# Altium project UPCNSL-ABS-PVC-DEP-1B.PrjPcb
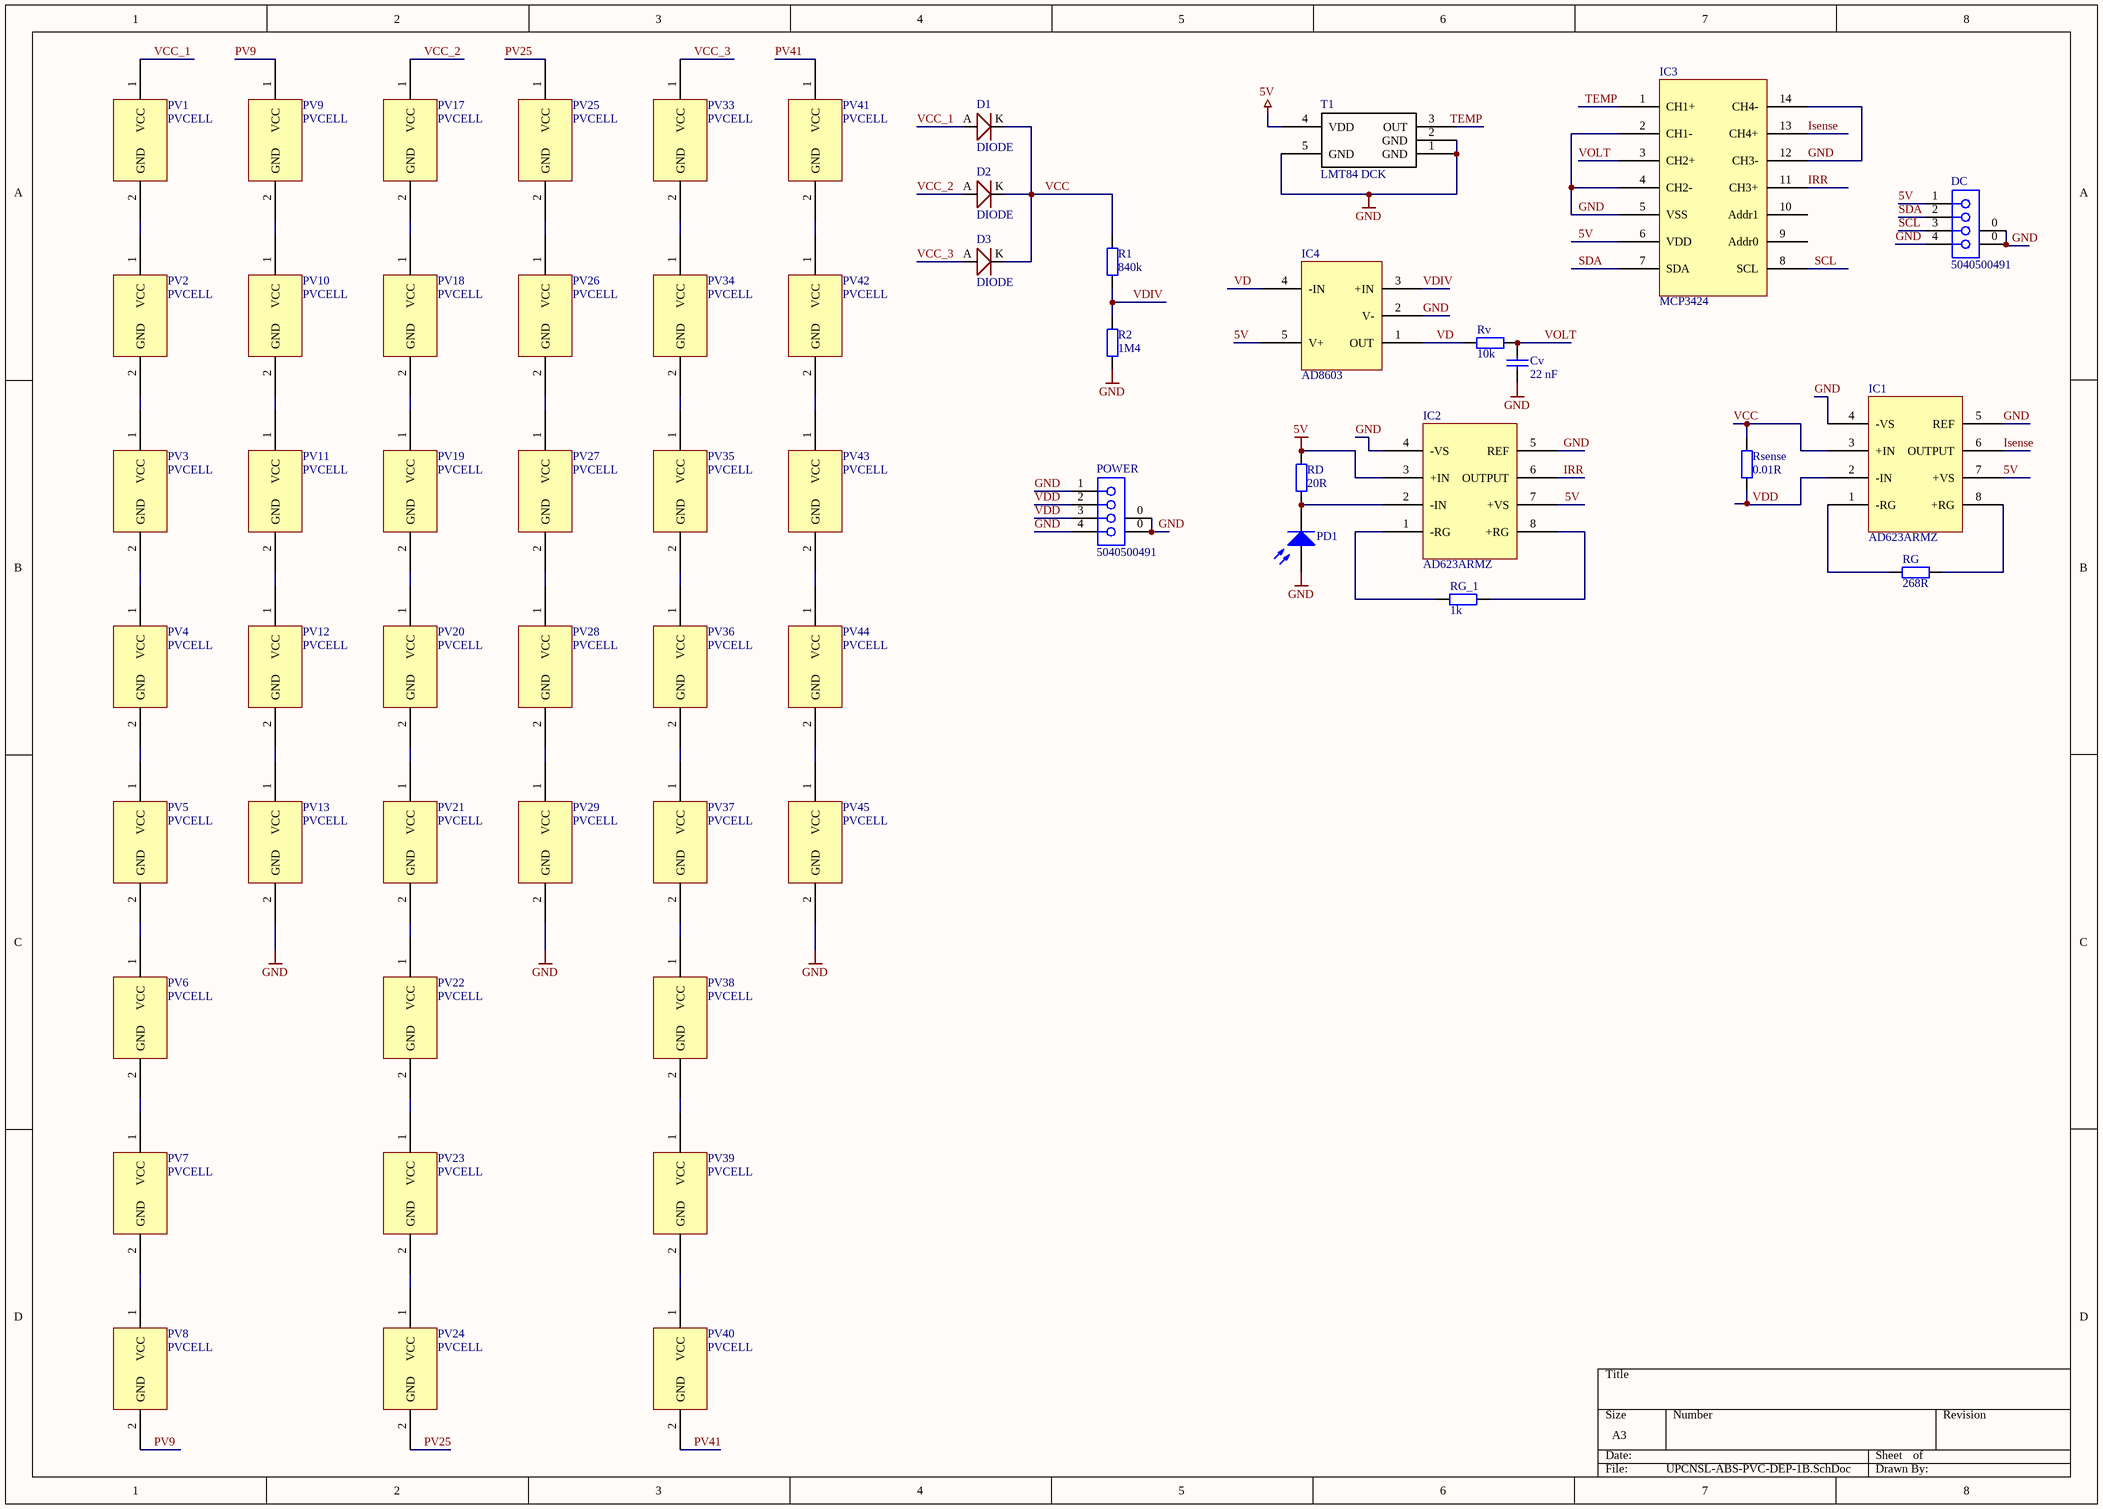
[diagram p0: UPCNSL-ABS-PVC-DEP-1B.SchDoc]
1 sheet, 58 parts. Net scope: global (net labels, ports and power ports of the same name join across sheets).
Board file: UPCNSL-ABS-PVC-DEP-1B.PcbDoc

## Sheet UPCNSL-ABS-PVC-DEP-1B.SchDoc
size A3

### Parts
Cv  value 22 nF  [CAP0603]  (hidden comment: CAP0603)
D1  DIODE  [(Schottky diode) SODFL160X70-2N]
D2  DIODE  [(Schottky diode) SODFL160X70-2N]
D3  DIODE  [(Schottky diode) SODFL160X70-2N]
DC  5040500491  [5040500491]
IC1  AD623ARMZ  [AD623ARMZ]
IC2  AD623ARMZ  [AD623ARMZ]
IC3  MCP3424  [MCP3424]
IC4  AD8603  [AD8603]
PD1  Photo Sen  [C0805]  (value not drawn)
POWER  5040500491  [5040500491]
PV1  PVCELL  [PV CELLS]
PV2  PVCELL  [PV CELLS]
PV3  PVCELL  [PV CELLS]
PV4  PVCELL  [PV CELLS]
PV5  PVCELL  [PV CELLS]
PV6  PVCELL  [PV CELLS]
PV7  PVCELL  [PV CELLS]
PV8  PVCELL  [PV CELLS]
PV9  PVCELL  [PV CELLS]
PV10  PVCELL  [PV CELLS]
PV11  PVCELL  [PV CELLS]
PV12  PVCELL  [PV CELLS]
PV13  PVCELL  [PV CELLS]
PV17  PVCELL  [PV CELLS]
PV18  PVCELL  [PV CELLS]
PV19  PVCELL  [PV CELLS]
PV20  PVCELL  [PV CELLS]
PV21  PVCELL  [PV CELLS]
PV22  PVCELL  [PV CELLS]
PV23  PVCELL  [PV CELLS]
PV24  PVCELL  [PV CELLS]
PV25  PVCELL  [PV CELLS]
PV26  PVCELL  [PV CELLS]
PV27  PVCELL  [PV CELLS]
PV28  PVCELL  [PV CELLS]
PV29  PVCELL  [PV CELLS]
PV33  PVCELL  [PV CELLS]
PV34  PVCELL  [PV CELLS]
PV35  PVCELL  [PV CELLS]
PV36  PVCELL  [PV CELLS]
PV37  PVCELL  [PV CELLS]
PV38  PVCELL  [PV CELLS]
PV39  PVCELL  [PV CELLS]
PV40  PVCELL  [PV CELLS]
PV41  PVCELL  [PV CELLS]
PV42  PVCELL  [PV CELLS]
PV43  PVCELL  [PV CELLS]
PV44  PVCELL  [PV CELLS]
PV45  PVCELL  [PV CELLS]
R1  value 840k  [RES0603]  (hidden comment: RES0603)
R2  value 1M4  [RES0603]  (hidden comment: RES0603)
RD  value 20R  [RES0603]  (hidden comment: RES0603)
RG  value 268R  [RES0603]  (hidden comment: RES0603)
RG_1  value 1k  [RES0603]  (hidden comment: RES0603)
Rsense  value 0.01R  [RES0603]  (hidden comment: RES0603)
Rv  value 10k  [RES0603]  (hidden comment: RES0603)
T1  LMT84 DCK  [DCK/SOT65P210X110-5N]

### Nets
5V: DC.1 IC1.7(+VS) IC2.3(+IN) IC2.7(+VS) IC3.6(VDD) IC4.5(V+) RD.2 T1.4(VDD)
GND: Cv.1 DC.0(MH1) DC.4 IC1.4(-VS) IC1.5(REF) IC2.4(-VS) IC2.5(REF) IC3.2(CH1-) IC3.4(CH2-) IC3.5(VSS) IC3.12(CH3-) IC3.14(CH4-) IC4.2(V-) PD1.1(A) POWER.0(MH1) POWER.1 POWER.4 PV13.2(GND) PV29.2(GND) PV45.2(GND) R2.1 T1.1(GND) T1.2(GND) T1.5(GND)
IRR: IC2.6(OUTPUT) IC3.11(CH3+)
Isense: IC1.6(OUTPUT) IC3.13(CH4+)
PV9: PV8.2(GND) PV9.1(VCC)
PV25: PV24.2(GND) PV25.1(VCC)
PV41: PV40.2(GND) PV41.1(VCC)
SCL: DC.3 IC3.8(SCL)
SDA: DC.2 IC3.7(SDA)
TEMP: IC3.1(CH1+)
VCC: D1.K D2.K D3.K IC1.3(+IN) R1.2 Rsense.2
VCC_1: D1.A PV1.1(VCC)
VCC_2: D2.A PV17.1(VCC)
VCC_3: D3.A PV33.1(VCC)
VD: IC4.1(OUT) IC4.4(-IN) Rv.1
VDD: IC1.2(-IN) POWER.2 POWER.3 Rsense.1
VDIV: IC4.3(+IN) R1.1 R2.2
VOLT: Cv.2 IC3.3(CH2+) Rv.2
NetIC1_1: IC1.1(-RG) RG.1
NetIC1_8: IC1.8(+RG) RG.2
NetIC2_1: IC2.1(-RG) RG_1.1
NetIC2_2: IC2.2(-IN) PD1.2(K) RD.1
NetIC2_8: IC2.8(+RG) RG_1.2
NetPV1_2: PV1.2(GND) PV2.1(VCC)
NetPV2_2: PV2.2(GND) PV3.1(VCC)
NetPV3_2: PV3.2(GND) PV4.1(VCC)
NetPV4_2: PV4.2(GND) PV5.1(VCC)
NetPV5_2: PV5.2(GND) PV6.1(VCC)
NetPV6_2: PV6.2(GND) PV7.1(VCC)
NetPV7_2: PV7.2(GND) PV8.1(VCC)
NetPV9_2: PV9.2(GND) PV10.1(VCC)
NetPV10_2: PV10.2(GND) PV11.1(VCC)
NetPV11_2: PV11.2(GND) PV12.1(VCC)
NetPV12_2: PV12.2(GND) PV13.1(VCC)
NetPV17_2: PV17.2(GND) PV18.1(VCC)
NetPV18_2: PV18.2(GND) PV19.1(VCC)
NetPV19_2: PV19.2(GND) PV20.1(VCC)
NetPV20_2: PV20.2(GND) PV21.1(VCC)
NetPV21_2: PV21.2(GND) PV22.1(VCC)
NetPV22_2: PV22.2(GND) PV23.1(VCC)
NetPV23_2: PV23.2(GND) PV24.1(VCC)
NetPV25_2: PV25.2(GND) PV26.1(VCC)
NetPV26_2: PV26.2(GND) PV27.1(VCC)
NetPV27_2: PV27.2(GND) PV28.1(VCC)
NetPV28_2: PV28.2(GND) PV29.1(VCC)
NetPV33_2: PV33.2(GND) PV34.1(VCC)
NetPV34_2: PV34.2(GND) PV35.1(VCC)
NetPV35_2: PV35.2(GND) PV36.1(VCC)
NetPV36_2: PV36.2(GND) PV37.1(VCC)
NetPV37_2: PV37.2(GND) PV38.1(VCC)
NetPV38_2: PV38.2(GND) PV39.1(VCC)
NetPV39_2: PV39.2(GND) PV40.1(VCC)
NetPV41_2: PV41.2(GND) PV42.1(VCC)
NetPV42_2: PV42.2(GND) PV43.1(VCC)
NetPV43_2: PV43.2(GND) PV44.1(VCC)
NetPV44_2: PV44.2(GND) PV45.1(VCC)

Not connected (* = marked no-connect by the designer): IC3 9(Addr0) 10(Addr1); T1 3(OUT)

### Notes on the sheet
- Labels drawn without touching a wire or pin: TEMP

### Library data of the parts
Cv = CAP0603: Capacitor
DC POWER = MOLEX_5040500491: 1.50mm Pitch Pico-Lock™ Surface Mount Wire-to-Board Header, Right Angle,2.00mm Mated Height, Positive Side Locks, 4 Circuits; Supplier 1: Mouser; Supplier Part Number 1: 538-504050-0491
IC3 = MCP3424: 18-Bit, Multi-Channel ΔΣ Analog-to-Digital Converter with  I2C
PD1 = Photo Sen: Photosensitive Diode; Published: 24-Mar-1999; LatestRevisionDate: 17-Jul-2002; LatestRevisionNote: Re-released for DXP Platform.; PackageReference: PIN2; Publisher: Altium Limited
PV1-PV13 PV17-PV29 PV33-PV45 = PVCELLS: IXYS KXOB22-12X1L-ND
R1 R2 RD RG RG_1 Rsense Rv = RES0603: Resistor